# Altium schematic sheet Pressure sensor - SCP1000-D01.SchDoc: Pressure sensor -SPI
size A4; Organization: Altium Limited; Address1: 3 Minna Close; Address2: Belrose; Address3: NSW 2085; Address4: Australia
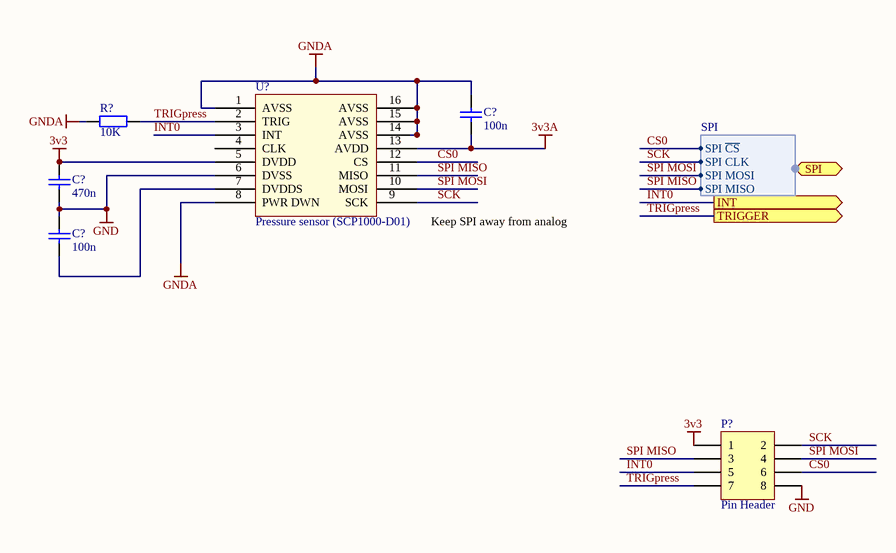
[diagram p0: Pressure sensor - SCP1000-D01.SchDoc]

## Parts
(Parts that share a designator on the sheet are numbered #1, #2 ... from top to bottom, then left to right.)
C?#1  100n  [C0805]
C?#2  470n  [C0805]
C?#3  100n  [C0805]
P?  Pin Header  [PH2x4_2.54]
R?  value 10K  [R0805]  (hidden comment: RESISTOR)
U?  Pressure sensor (SCP1000-D01)  [SCP1000-D01]

## Ports
INT (out), SPI (harness SPI), TRIGGER (out)

## Harnesses
SPI: SPI ~{CS}, SPI CLK, SPI MOSI, SPI MISO

## Nets
3v3: C?#2.2 P?.1 U?.5(DVDD)
3v3A: C?#1.1 U?.13(AVDD)
GND: C?#2.1 C?#3.2 P?.8 U?.6(DVSS)
GNDA: C?#1.2 R?.1 U?.1(AVSS) U?.8(PWR_DWN) U?.14(AVSS) U?.15(AVSS) U?.16(AVSS)
CS0: P?.6 U?.12(CS) ; port SPI.SPI ~{CS}
INT0: P?.5 U?.3(INT) ; port INT
SCK: P?.2 U?.9(SCK) ; port SPI.SPI CLK
SPI MISO: P?.3 U?.11(MISO) ; port SPI.SPI MISO
SPI MOSI: P?.4 U?.10(MOSI) ; port SPI.SPI MOSI
TRIGpress: P?.7 R?.2 U?.2(TRIG) ; port TRIGGER
NetC?#3_1: C?#3.1 U?.7(DVDDS)

Not connected (* = marked no-connect by the designer): U? 4(CLK)

## Notes on the sheet
- Keep SPI away from analog
- Disclaimer
  Any design and information, hardware or software  is provided on an "as-is" basis without warranty of any kind and any express or implied warranties, including, but not limited to, the implied warranties of merchantability and fitness for a particular purpose are disclaimed. In no event shall wnpd (or KeaDrone)be liable for any direct, indirect, incidental, special, exemplary, or consequential damages (including, but not limited to, procurement of substitute goods or services; loss of use, data, or profits; or business interruption) however caused and on any theory of liability, whether in contract, strict liability, or tort (including negligence or otherwise) arising in any way out of the use of this firmware, hardware, software or information, even if wnpd (or KeaDrone) has been advised by user of the possibility of such potential loss or damage. The user agrees to hold wnpd (or KeaDrone) harmless from and against any and all claims, losses, liabilities and expenses.
- Title
- Size:
- Date:
- A4
- Name:
- Time:
- Ing. W. Pietersz
- Revision:
- Sheet
- of
- WillyPietersz@gmail.com
- Contact:
- -
- www.wnpd.nl
- File:

## Library data of the parts
C?#1 C?#3 = 100n: Tolerance: 0.1; LatestRevision Note: Initial Release; Part Number: 100n; Value: 100n; Package: 0805; Component Type: Standard; LatestRevision Date: 31-7-2010; Author: Willy Pietersz; Supplier 2: Farnell; Supplier Part Number 2: 1759266; ComponentLink1Description: Manufacturer; ComponentLink2Description: Datasheet
C?#2 = 470n: Tolerance: 0.1; LatestRevision Note: Initial Release; Part Number: 470n; Value: 470n; Package: 0805; Component Type: Standard; LatestRevision Date: 31-7-2010; Author: Willy Pietersz; ComponentLink1Description: Manufacturer; ComponentLink2Description: Datasheet
P? = PH2x4: Header, 4-Pin, Dual row; Part Number: PH2x4; Pitch: 2.54; LatestRevision Note: Initial Release; Type: Pin Header; Number Of Pins: 8; Component Type: Standard; LatestRevision Date: 23-11-2010; Author: Willy Pietersz; Supplier 2: Farnell
R? = 10K: Manufacturer 1: Panasonic; Manufacturer 1 Part No: ERJT06J103V; Power: 0.25W; Tolerance: 0.05; LatestRevision Note: Initial Release; Published: 8-Jun-2000; LatestRevisionDate: 17-Jul-2002; LatestRevisionNote: Re-released for DXP Platform.; PackageReference: AXIAL-0.4; Publisher: Altium Limited; Part Number: 10K; Type: Film; Package: 0805; Component Type: Standard; LatestRevision Date: 30-7-2010; Author: Willy Pietersz; ROHS: Y; Supplier 2: Farnell; Supplier Part Number 2: 1618242; ComponentLink1Description: Manufacturer; ComponentLink2Description: Datasheet
U? = SCP1000-D01: Part Number: SCP1000-D01; Component Type: Sensor; Supplier 1: Sparkfun; Supplier Part Number 1: SCP1000-D01; ComponentLink1Description: Datasheet; ComponentLink1URL: http://www.sparkfun.com/datasheets/Components/SCP1000-D01.pdf